# Altium schematic sheet Optocoupler.SchDoc
size A4; SheetNumber: 9; SheetTotal: 11
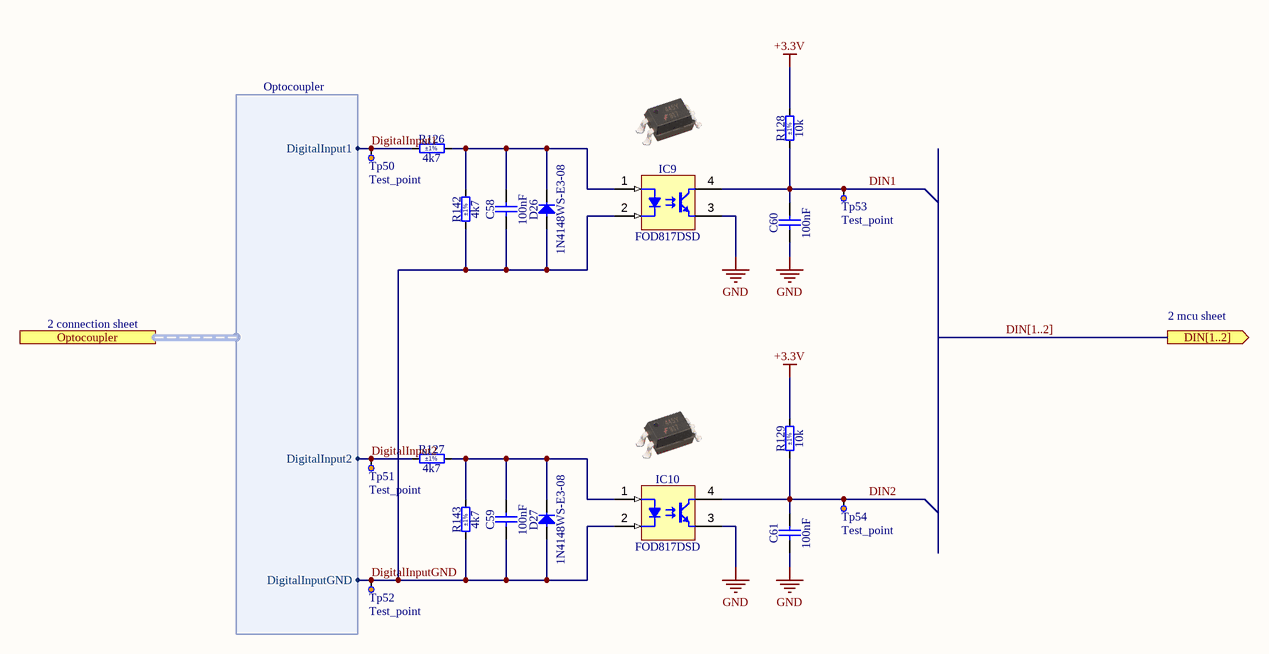
[diagram p0: Optocoupler.SchDoc]

## Parts
C58  100nF  [CAPC1608X87N]
C59  100nF  [CAPC1608X87N]
C60  100nF  [CAPC1608X87N]
C61  100nF  [CAPC1608X87N]
D26  1N4148WS-E3-08  [SOD2713X115N]
D27  1N4148WS-E3-08  [SOD2713X115N]
IC9  FOD817DSD  [FAIRCHILD_FOD817DSD]
IC10  FOD817DSD  [FAIRCHILD_FOD817DSD]
R126  4k7  Tolerance: ±1%  [RESC6331X70N]
R127  4k7  Tolerance: ±1%  [RESC6331X70N]
R128  10k  Tolerance: ±1%  [RESC1608X55N]
R129  10k  Tolerance: ±1%  [RESC1608X55N]
R142  4k7  Tolerance: ±1%  [RESC1608X55N]
R143  4k7  Tolerance: ±1%  [RESC1608X55N]
Tp50  Test_point  [TP_C40]
Tp51  Test_point  [TP_C40]
Tp52  Test_point  [TP_C40]
Tp53  Test_point  [TP_C40]
Tp54  Test_point  [TP_C40]

## Ports
DIN[1..2] (out), Optocoupler (harness Optocoupler)

## Harnesses
Optocoupler: DigitalInput1, DigitalInput2, DigitalInputGND

## Nets
+3.3V: R128.2 R129.2
GND: C60.1 C61.1 IC9.3(E) IC10.3(E)
DigitalInput1: R126.1 Tp50.1 ; port Optocoupler.DigitalInput1
DigitalInput2: R127.1 Tp51.1 ; port Optocoupler.DigitalInput2
DigitalInputGND: C58.1 C59.1 D26.2(A) D27.2(A) IC9.2(C) IC10.2(C) R142.1 R143.1 Tp52.1 ; port Optocoupler.DigitalInputGND
DIN1: C60.2 IC9.4(C) R128.1 Tp53.1
DIN2: C61.2 IC10.4(C) R129.1 Tp54.1
NetC58_2: C58.2 D26.1(C) IC9.1(A) R126.2 R142.2
NetC59_2: C59.2 D27.1(C) IC10.1(A) R127.2 R143.2

## Buses and harness runs
bus DIN[1..2] = port DIN[1..2]

## Notes on the sheet
- 2 connection sheet
- 2 mcu sheet
- THIS DOCUMENT AND THE DATA DISCLOSED HEREIN OR
- HEREWITH IS THE PROPERTY OF ALTIUM LIMITED AND MAY
- DWG NO:
- REVISION
- REV:
- DESCRIPTION
- DATE
- APPROVED
- BE FREELY DISTRIBUTED IN WHOLE. NO RIGHTS ARE
- RESERVED OR EXPRESS OR IMPLIED WARANTEE GIVEN.
- ENG:
- APPROVALS
- PROJECT
- DSN:
- CHK:
- REFERENCE DOCUMENTS
- PROJECT REVISION:
- TITLE
- DOCUMENT REVISION:
- DESIGN ITEM:
- BOM:
- FAB DWG:
- PCB DWG:
- ASSY DWG:
- SCALE:
- A3
- SIZE
- CAGE CODE
- FILE NAME
- DWG NO.
- SHEET
- OF
- REV

## Library data of the parts
C58-C61 = CC0603_100NF_50V_10%_X7R: Non-polarised capacitor; Part Description: SMD Multilayer Chip Ceramic Capacitor; Manufacturer: GENERIC; Manufacturer1 Part Number: 223858615649; Voltage: 50V; TC: X7R; Tolerance: ±10%; Part Number: CC0603_100NF_50V_10%_X7R; Component Kind: Standard; Component Type: Standard; Pin Count: 2; Value: 100nF; Status: Preferred; Manufacturer Part Number: CC0603_100NF_50V_10%_X7R; Case: 0603; Mounted: Yes; Socket: No; SMD: Yes; Sense: No; Manufacturer1 Example: PHYCOMP; Manufacturer1 ComponentHeight: 0.87mm; HelpURL: \\cern.ch\dfs\Applications\Altium\Datasheets\CC0603_X7R_PHYCOMP.pdf; Author: CERN DEM JLC; CreateDate: 03.12.2007; LatestRevisionDate: 03.12.2007
D26 D27 = 1N4148WS-E3-08: Diode; Part Description: Small Signal Fast Switching Diode; Manufacturer: VISHAY SEMICONDUCTORS; Voltage: 75V; Power: 150mA; PressFit: No; Bonding: No; Part Number: 1N4148WS-E3-08; Component Kind: Standard; Component Type: Standard; Device: 1N4148WS-E3-08; PackageDescription: SOD-323 Diode; 1.775mm W X 1.30mm L X 1.15mm H Body, IPC Medium Density; Manufacturer Part Number: 1N4148WS-E3-08; Pin Count: 3; Case: SOD-323; Mounted: Yes; Socket: No; SMD: Yes; Sense: No; ComponentHeight: 1.15mm; HelpURL: \\cern.ch\dfs\Applications\Altium\Datasheets\1N4148WS-E3-08.pdf; Author: CERN DEM JLC; CreateDate: 16.12.2013; LatestRevisionDate: 16.12.2013
IC9 IC10 = FOD817DSD: Single Optocoupler; Part Description: 4-Pin High Operating Temperature Phototransistor Optocoupler; Manufacturer: FAIRCHILD SEMICONDUCTOR; PressFit: No; Bonding: No; Part Number: FOD817DSD; Component Kind: Standard; Component Type: Standard; Device: FOD817DSD; PackageDescription: SOIC, 2.54mm Pitch; 4 Pin, 6.50mm W X 4.60mm L X 4.60mm H body; Manufacturer Part Number: FOD817DSD; Pin Count: 4; Case: SOIC4; Mounted: Yes; Socket: No; SMD: Yes; Sense: No; ComponentHeight: 4.6mm; HelpURL: \\cern.ch\dfs\Applications\Altium\Datasheets\FOD817DSD.pdf; Author: CERN DEM JLC; CreateDate: 21.07.2014; LatestRevisionDate: 21.07.2014
R126 R127 = R2512_4K7_1%_1W_100PPM: Resistor - 1%; Part Description: Thick Film Chip Resistor; Manufacturer: GENERIC; Manufacturer1 Part Number: 232276364702L or RC2512FK-074K7L; Power: 1W; TC: ±100ppm/°C; PressFit: No; Part Number: R2512_4K7_1%_1W_100PPM; Component Kind: Standard; Component Type: Standard; Pin Count: 2; Value: 4k7; Status: Preferred; Manufacturer Part Number: R2512_4K7_1%_1W_100PPM; Case: 2512; Mounted: Yes; Sense: No; Socket: No; SMD: Yes; Manufacturer1 Example: YAGEO PHYCOMP; Manufacturer1 ComponentHeight: 0.65mm; HelpURL: \\cern.ch\dfs\Applications\Altium\Datasheets\R2512_Phycomp_RC2512.pdf; Author: CERN DEM JLC; CreateDate: 21.07.2008; LatestRevisionDate: 17.10.2012
R128 R129 = R0603_10K_1%_0.1W_100PPM: Resistor - 1%; Part Description: General Purpose Thick Film Chip Resistor; Manufacturer: GENERIC; Manufacturer1 Part Number: NRC06F1002TRF; Power: 0.1W; TC: ±100ppm/°C; PressFit: No; Part Number: R0603_10K_1%_0.1W_100PPM; Component Kind: Standard; Component Type: Standard; Pin Count: 2; Value: 10k; Status: Preferred; Manufacturer Part Number: R0603_10K_1%_0.1W_100PPM; Case: 0603; Mounted: Yes; Sense: No; Socket: No; SMD: Yes; Manufacturer1 Example: NIC COMPONENT; Manufacturer1 ComponentHeight: 0.55mm; HelpURL: \\cern.ch\dfs\Applications\Altium\Datasheets\R0603_NIC_NRC.pdf; Author: CERN DEM JLC; CreateDate: 03.12.2007; LatestRevisionDate: 13.03.2008
R142 R143 = R0603_4K7_1%_0.1W_100PPM: Resistor - 1%; Part Description: General Purpose Thick Film Chip Resistor; Manufacturer: GENERIC; Manufacturer1 Part Number: NRC06F4701TRF; Power: 0.1W; TC: ±100ppm/°C; PressFit: No; Part Number: R0603_4K7_1%_0.1W_100PPM; Component Kind: Standard; Component Type: Standard; Pin Count: 2; Value: 4k7; Status: Preferred; Manufacturer Part Number: R0603_4K7_1%_0.1W_100PPM; Case: 0603; Mounted: Yes; Sense: No; Socket: No; SMD: Yes; Manufacturer1 Example: NIC COMPONENT; Manufacturer1 ComponentHeight: 0.55mm; HelpURL: \\cern.ch\dfs\Applications\Altium\Datasheets\R0603_NIC_NRC.pdf; Author: CERN DEM JLC; CreateDate: 03.12.2007; LatestRevisionDate: 13.03.2008
Tp50-Tp54 = Test point: Published: 8-Jun-2000; LatestRevisionDate: 17-Jul-2002; LatestRevisionNote: Re-released for DXP Platform.; PackageReference: AXIAL-0.3; Publisher: Altium Limited